# EAGLE design untitled (EAGLE 7.7.0)
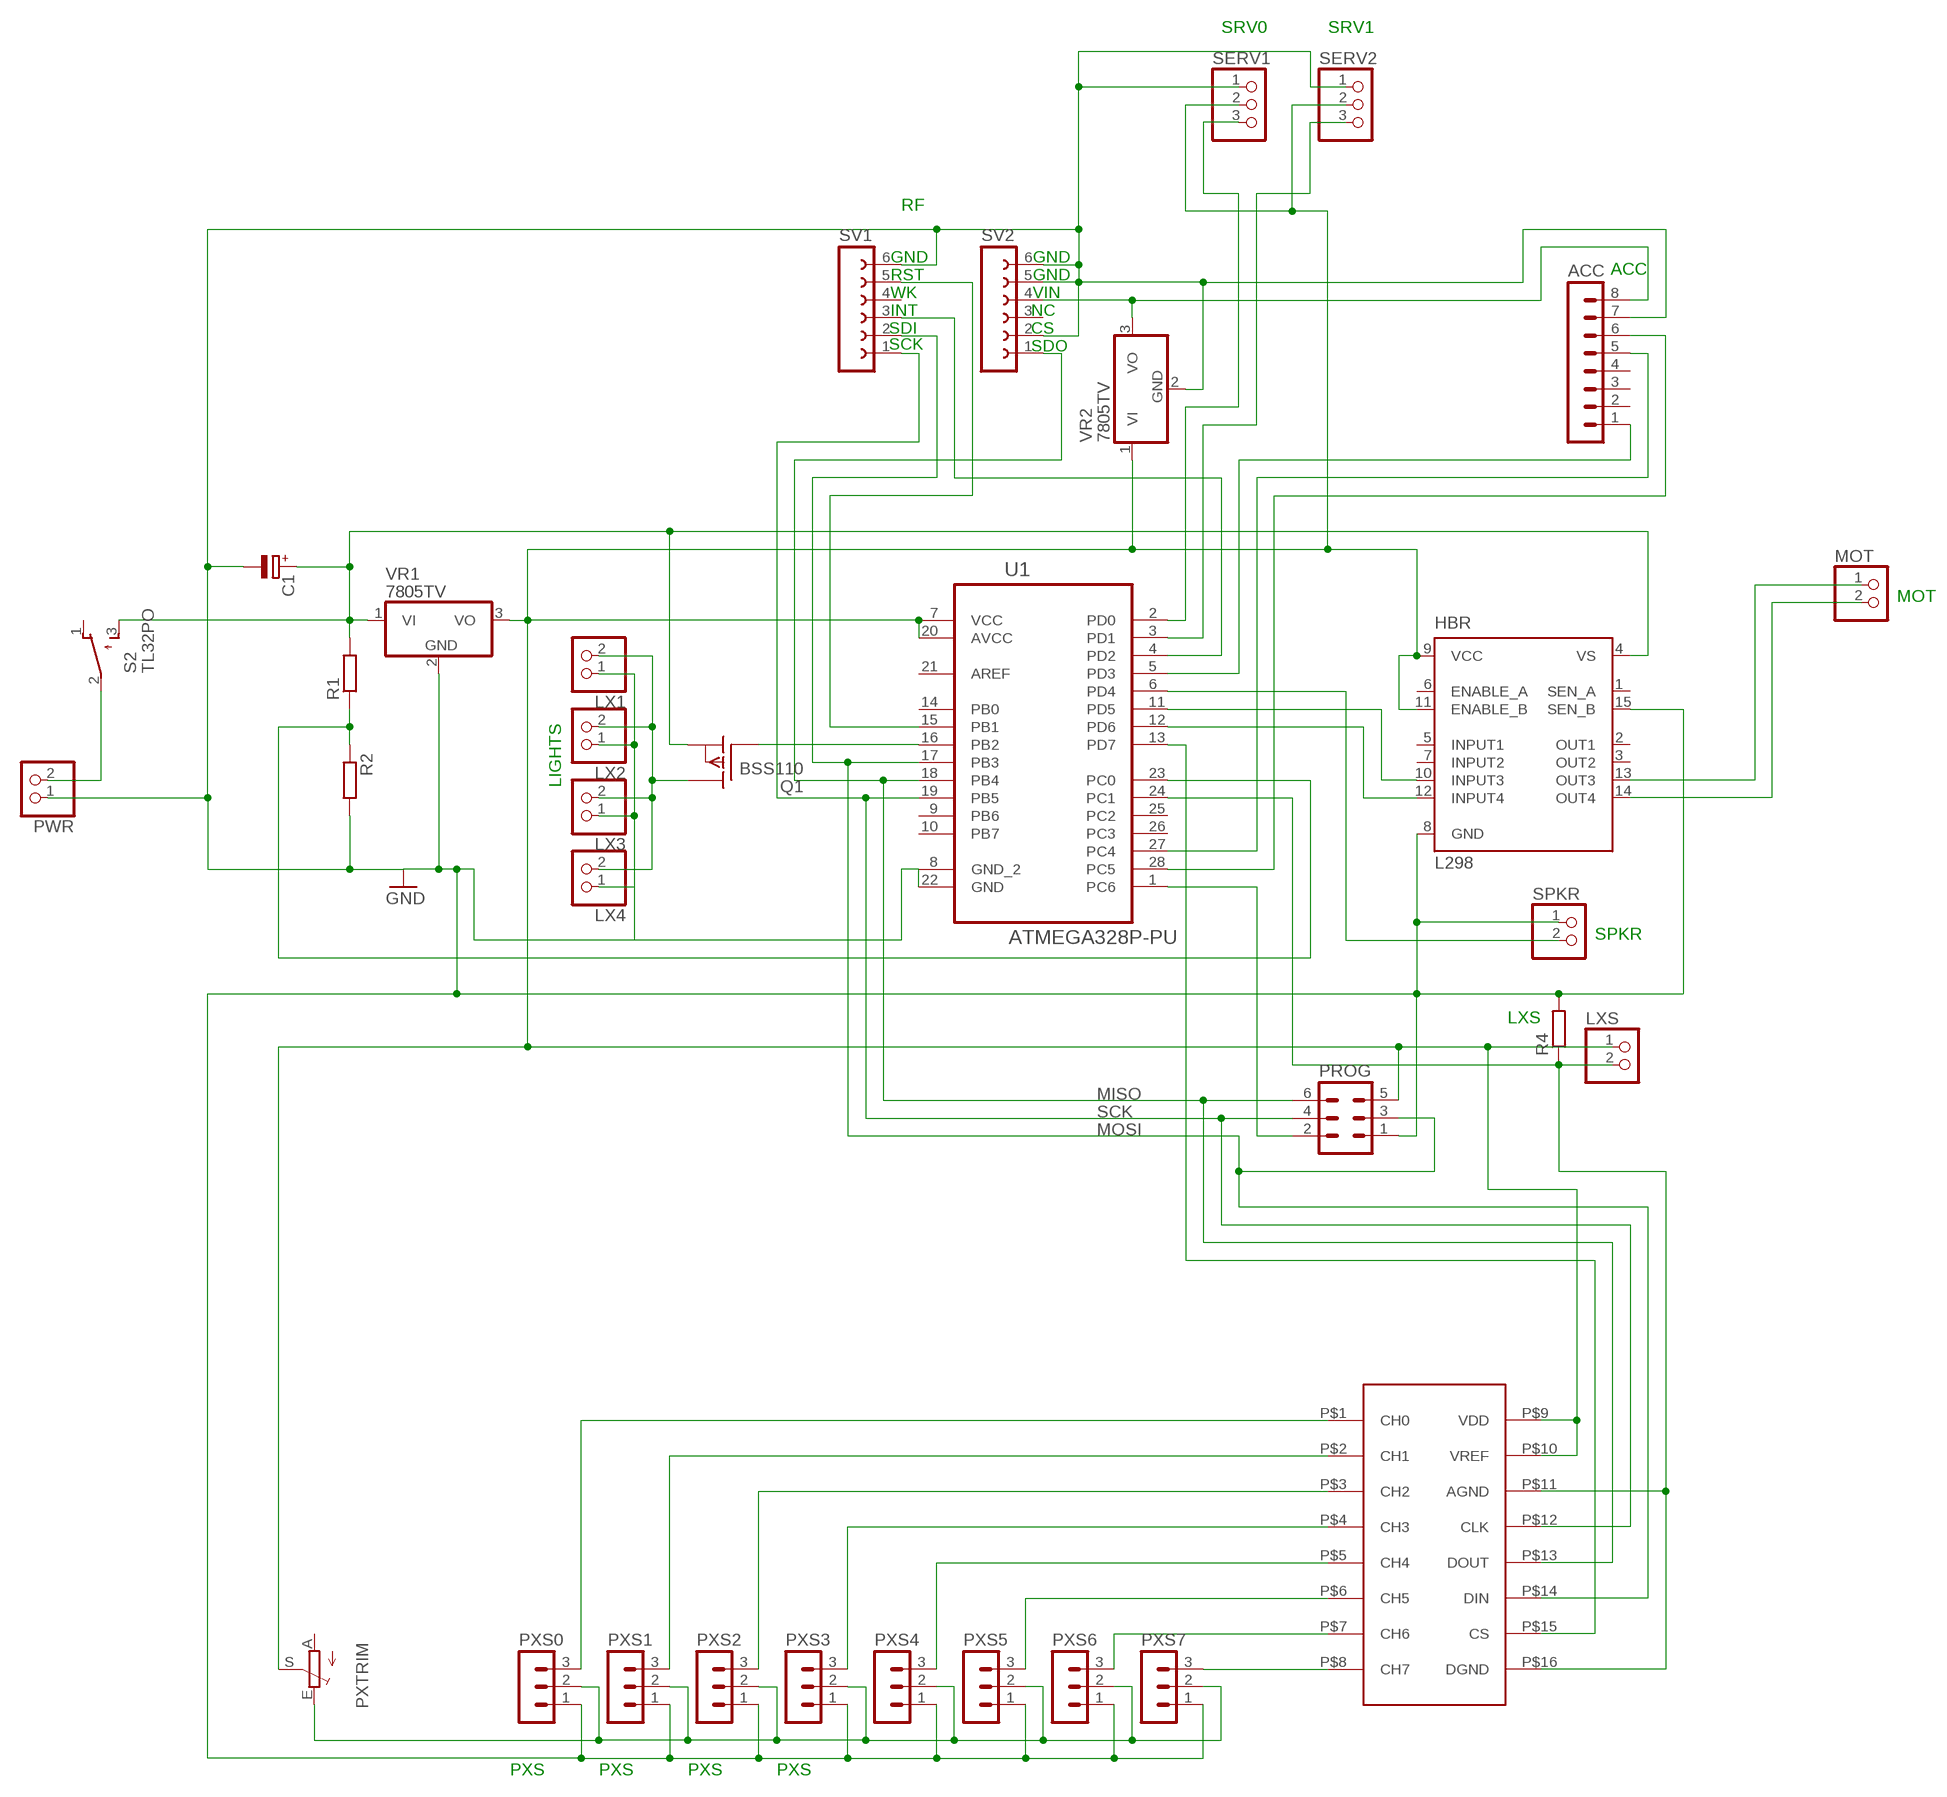
[diagram p0: schematic, sheet 1]

## Parts
ACC  MA08-1  [MA08-1]
C1  CPOL-EUE2.5-7  [E2,5-7]
HBR  L298  [MULTIWATT-15]
LX1  PINHD-1X2  [1X02]
LX2  PINHD-1X2  [1X02]
LX3  PINHD-1X2  [1X02]
LX4  PINHD-1X2  [1X02]
LXS  PINHD-1X2  [1X02]
MOT  PINHD-1X2  [1X02]
PROG  MA03-2  [MA03-2]
PWR  PINHD-1X2  [1X02]
PXS0  MA03-1  [MA03-1]
PXS1  MA03-1  [MA03-1]
PXS2  MA03-1  [MA03-1]
PXS3  MA03-1  [MA03-1]
PXS4  MA03-1  [MA03-1]
PXS5  MA03-1  [MA03-1]
PXS6  MA03-1  [MA03-1]
PXS7  MA03-1  [MA03-1]
PXTRIM  TRIM_EU-CA9V  [CA9V]
Q1  BSS110  [TO92]
R1  R-EU_0309/V  [0309V]
R2  R-EU_0309/V  [0309V]
R4  R-EU_0309/V  [0309V]
S2  TL32PO  [TL3XPO]
SERV1  PINHD-1X3  [1X03]
SERV2  PINHD-1X3  [1X03]
SPKR  PINHD-1X2  [1X02]
SV1  FE06-1  [FE06]
SV2  FE06-1  [FE06]
U1  ATMEGA328P-PU  [DIP254P762X457-28]
U$1  MCP3208  [DIP16]
VR1  7805TV  [TO220V]
VR2  7805TV  [TO220V]

## Nets
GND: ACC.7 C1.- HBR.8(GND) HBR.15(SEN_B) LX1.1 LX2.1 LX3.1 LX4.1 PROG.1 PWR.1 PXS0.1 PXS1.1 PXS2.1 PXS3.1 PXS4.1 PXS5.1 PXS6.1 PXS7.1 R2.2 R4.2 SERV1.1 SERV2.1 SPKR.1 SV1.6 SV2.2 SV2.5 SV2.6 U1.8(GND_2) U1.22(GND) VR1.2(GND) VR2.2(GND)
MISO: PROG.6 SV2.1 U1.18(PB4) U$1.P$13(DOUT)
MOSI: PROG.3 SV1.2 U1.17(PB3) U$1.P$14(DIN)
N$1: R1.1 R2.1 U1.23(PC0)
N$2: U1.13(PD7) U$1.P$15(CS)
N$3: SERV1.3 U1.2(PD0)
N$4: HBR.13(OUT3) MOT.1
N$5: HBR.14(OUT4) MOT.2
N$6: PXS7.3 U$1.P$8(CH7)
N$7: HBR.12(INPUT4) U1.12(PD6)
N$8: PXS6.3 U$1.P$7(CH6)
N$9: PXS5.3 U$1.P$6(CH5)
N$10: ACC.6 U1.28(PC5)
N$11: PXS4.3 U$1.P$5(CH4)
N$12: PXS3.3 U$1.P$4(CH3)
N$13: PXS2.3 U$1.P$3(CH2)
N$14: PXS1.3 U$1.P$2(CH1)
N$15: ACC.5 U1.27(PC4)
N$16: PXS0.3 U$1.P$1(CH0)
N$17: ACC.1 U1.5(PD3)
N$21: HBR.10(INPUT3) U1.11(PD5)
N$24: PXS0.2 PXS1.2 PXS2.2 PXS3.2 PXS4.2 PXS5.2 PXS6.2 PXS7.2 PXTRIM.E
N$25: SERV2.3 U1.3(PD1)
N$26: Q1.2(G) U1.16(PB2)
N$27: SPKR.2 U1.6(PD4)
N$28: LXS.2 R4.1 U1.24(PC1) U$1.P$11(AGND) U$1.P$16(DGND)
N$29: LX1.2 LX2.2 LX3.2 LX4.2 Q1.3(D)
R_INT: SV1.3 U1.4(PD2)
R_RST: SV1.5 U1.15(PB1)
RST: PROG.2 U1.1(PC6)
SCK: PROG.4 SV1.1 U1.19(PB5) U$1.P$12(CLK)
V3V: ACC.8 SV2.4 VR2.3(VO)
VCC: HBR.9(VCC) HBR.11(ENABLE_B) LXS.1 PROG.5 PXTRIM.S SERV1.2 SERV2.2 U1.7(VCC) U1.20(AVCC) U$1.P$9(VDD) U$1.P$10(VREF) VR1.3(VO) VR2.1(VI)
VSS: C1.+ HBR.4(VS) Q1.1(S) R1.2 S2.3(S) VR1.1(VI)
VSS_IN: PWR.2 S2.2(P)
Unconnected: ACC.2 ACC.3 ACC.4 HBR.1(SEN_A) HBR.2(OUT1) HBR.3(OUT2) HBR.5(INPUT1) HBR.6(ENABLE_A) HBR.7(INPUT2) PXTRIM.A S2.1(O) SV1.4 SV2.3 U1.9(PB6) U1.10(PB7) U1.14(PB0) U1.21(AREF) U1.25(PC2) U1.26(PC3)

## Notes on the sheet
- SRV0 | SRV1
- RF
- GND | GND
- ACC
- RST | GND
- WK | VIN
- INT | NC
- SDI | CS
- SCK | SDO
- MOT
- LIGHTS
- SPKR
- LXS
- PXS | PXS | PXS | PXS

## Library data of the parts
ACC = con-lstb:MA08-1: PIN HEADER; OC_FARNELL: unknown; OC_NEWARK: unknown
C1 = rcl:CPOL-EU: POLARIZED CAPACITOR, European symbol
HBR = st-microelectronics:L298: DUAL FULL-BRIDGE DRIVER; MPN: L298N; OC_FARNELL: 1589425; OC_NEWARK: 32M1527
LX1-LX4 LXS MOT PWR SPKR = pinhead:PINHD-1X2: PIN HEADER
PROG = con-lstb:MA03-2: PIN HEADER; OC_FARNELL: unknown; OC_NEWARK: unknown
PXS0 PXS1-PXS7 = con-lstb:MA03-1: PIN HEADER; OC_FARNELL: unknown; OC_NEWARK: unknown
PXTRIM = pot:TRIM_EU-: POTENTIOMETER
Q1 = transistor-fet:BSS110: P-Channel Enhancement MOSFET -50V; -0,17A; 6Ohm
R1 R2 R4 = resistor:R-EU_: RESISTOR, European symbol
S2 = switch:TL32PO: TINY SWITCH ON - MOM Source: http://www2.produktinfo.conrad.com/datenblaetter/700000-724999/705152-da-01-de-Subminiaturschalter_TL_36YO.pdf
SERV1 SERV2 = pinhead:PINHD-1X3: PIN HEADER
SV1 SV2 = con-lsta:FE06-1: FEMALE HEADER; OC_FARNELL: unknown; OC_NEWARK: unknown
U1 = Atmel_By_element14_Batch_1-00:ATMEGA328P-PU: 8-bit Microcontroller with In-System Programmable Flash; MPN: ATMEGA328P-PU; OC_FARNELL: 1715487; OC_NEWARK: 15R0268; PACKAGE: PDIP-28; SUPPLIER: Atmel
U$1 = MCP_ADC:MCP3208
VR1 VR2 = linear:78*: Positive VOLTAGE REGULATOR Source: http://cache.national.com/ds/LM/LM78L05.pdf http://www.fairchildsemi.com/ds/LM/LM7805.pdf

## Board
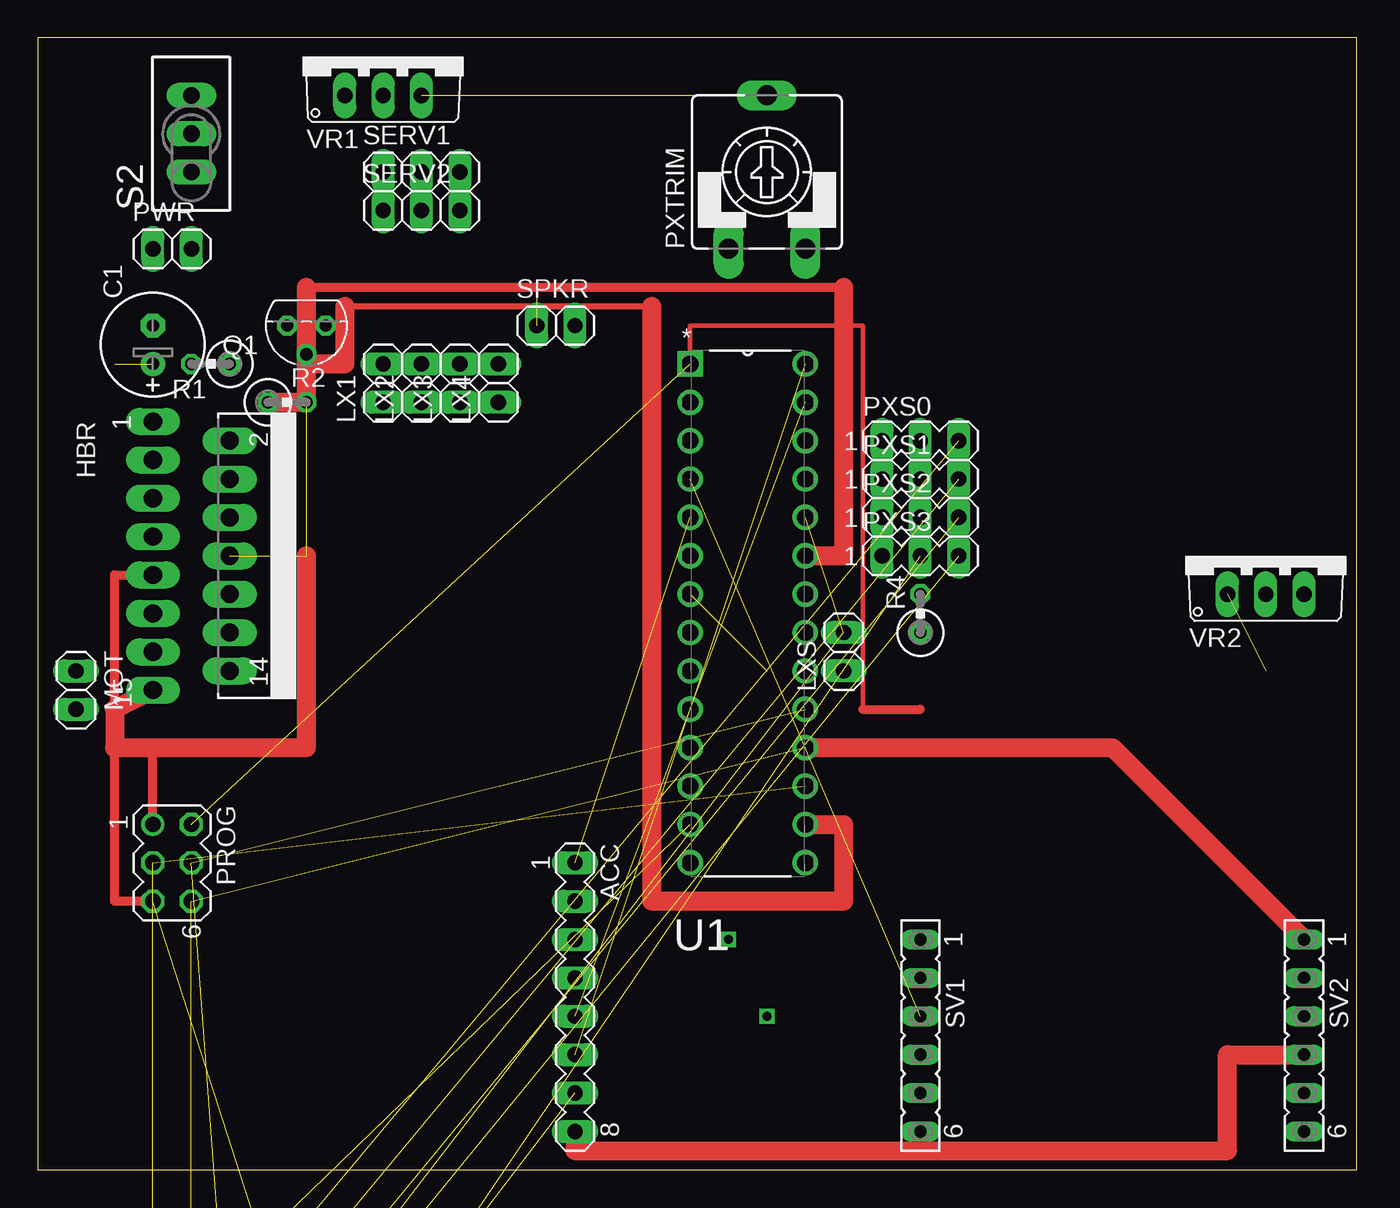
[diagram p1: board, top side]
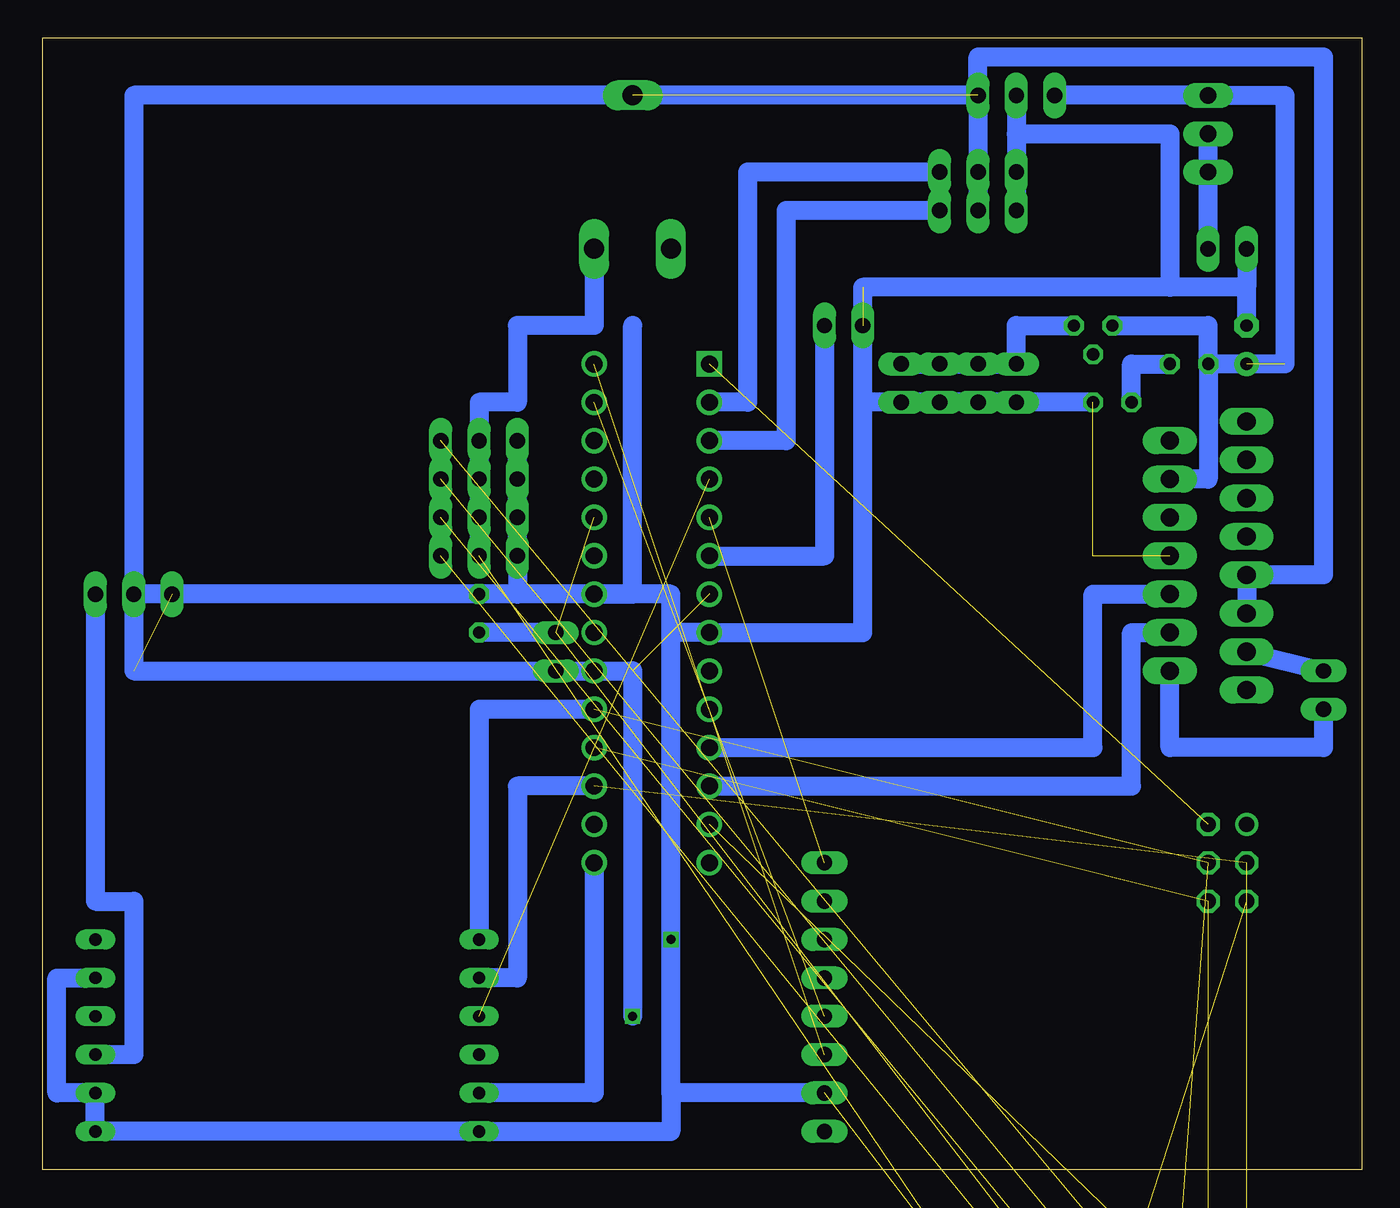
[diagram p2: board, bottom side, seen from below]

Size 87.3 x 74.92 mm. Coordinates in mm from the lower left corner, seen from the top.
Outline: 0,0 87.3,0 87.3,74.92 0,74.92 0,0
Copper layers (1*16): Top 0.035mm / dielectric 1.5mm / Bottom 0.035mm
Design rules "default": minimum track width 10mil, minimum drill 24mil, track to track 8mil, track to pad 8mil, pad to pad 8mil, via to via 8mil, smd to smd 8mil, copper to edge 40mil, drill to drill 8mil, minimum pad ring 10mil, minimum via ring 8mil, stop-mask expansion 4mil, vias tented up to drill 0mil, thermal gap 10mil

### Footprints (pad centres in the part's own frame; a part is rotated, then mirrored left to right if it is on the bottom)
MA08-1 = drill 1.016 long: 1 -8.89,0; 2 -6.35,0; 3 -3.81,0; 4 -1.27,0; 5 1.27,0; 6 3.81,0; 7 6.35,0; 8 8.89,0
E2,5-7 = drill 0.813 pad 1.6: + -1.27,0 | drill 0.813 pad 1.6 octagon: - 1.27,0
MULTIWATT-15 = drill 1.2 long: 1 -8.89,-7.62; 2 -7.62,-2.54; 3 -6.35,-7.62; 4 -5.08,-2.54; 5 -3.81,-7.62; 6 -2.54,-2.54; 7 -1.27,-7.62; 8 0,-2.54; 9 1.27,-7.62; 10 2.54,-2.54; 11 3.81,-7.62; 12 5.08,-2.54; 13 6.35,-7.62; 14 7.62,-2.54; 15 8.89,-7.62
1X02 = drill 1.016 long: 1 -1.27,0; 2 1.27,0
MA03-2 = drill 1.016: 1 -2.54,-1.27 | drill 1.016 octagon: 2 -2.54,1.27; 3 0,-1.27; 4 0,1.27; 5 2.54,-1.27; 6 2.54,1.27
MA03-1 = drill 1.016 long: 1 -2.54,0; 2 0,0; 3 2.54,0
CA9V = drill 1.321 long: A -2.54,-5.08; E 2.54,-5.08; S 0,5.08
TO92 = drill 0.813 octagon: 1 1.27,0; 2 0,1.905; 3 -1.27,0
0309V = drill 0.813 octagon: 1 -1.27,0; 2 1.27,0
TL3XPO = drill 1.1 pad 1.422 long: 1 -2.54,0; 2 0,0; 3 2.54,0
1X03 = drill 1.016 long: 1 -2.54,0; 2 0,0; 3 2.54,0
FE06 = drill 0.813 long: 1 -6.35,0; 2 -3.81,0; 3 -1.27,0; 4 1.27,0; 5 3.81,0; 6 6.35,0
DIP254P762X457-28 = drill 1.118 square: 1 -7.62,33.02 | drill 1.118: 2 -7.62,30.48; 3 -7.62,27.94; 4 -7.62,25.4; 5 -7.62,22.86; 6 -7.62,20.32; 7 -7.62,17.78; 8 -7.62,15.24; 9 -7.62,12.7; 10 -7.62,10.16; 11 -7.62,7.62; 12 -7.62,5.08; 13 -7.62,2.54; 14 -7.62,0; 15 0,0; 16 0,2.54; 17 0,5.08; 18 0,7.62; 19 0,10.16; 20 0,12.7; 21 0,15.24; 22 0,17.78; 23 0,20.32; 24 0,22.86; 25 0,25.4; 26 0,27.94; 27 0,30.48; 28 0,33.02
DIP16 = drill 0.8 long: P$1 -10.16,-3.81; P$2 -7.62,-3.81; P$3 -5.08,-3.81; P$4 -2.54,-3.81; P$5 0,-3.81; P$6 2.54,-3.81; P$7 5.08,-3.81; P$8 7.62,-3.81; P$9 7.62,3.81; P$10 5.08,3.81; P$11 2.54,3.81; P$12 0,3.81; P$13 -2.54,3.81; P$14 -5.08,3.81; P$15 -7.62,3.81; P$16 -10.16,3.81
TO220V = drill 1.016 long: 1 -2.54,-2.54; 2 0,-2.54; 3 2.54,-2.54

### Placement (x,y rotation side)
ACC  35.56,11.43 270 top
C1  7.62,54.61 90 top
HBR  15.24,40.64 270 top
LX1  22.86,52.07 90 top
LX2  25.4,52.07 90 top
LX3  27.94,52.07 90 top
LX4  30.48,52.07 90 top
LXS  53.34,34.29 90 top
MOT  2.54,31.75 270 top
PROG  8.89,20.32 270 top
PWR  8.89,60.96 0 top
PXS0  58.42,48.26 0 top
PXS1  58.42,45.72 0 top
PXS2  58.42,43.18 0 top
PXS3  58.42,40.64 0 top
PXS4  5.08,-38.1 0 top  (outside the outline)
PXS5  5.08,-53.34 0 top  (outside the outline)
PXS6  5.08,-68.58 0 top  (outside the outline)
PXS7  5.08,-83.82 0 top  (outside the outline)
PXTRIM  48.26,66.04 0 top
Q1  17.78,55.88 180 top
R1  11.43,53.34 180 top
R2  16.51,50.8 0 top
R4  58.42,36.83 90 top
S2  10.16,68.58 90 top
SERV1  25.4,66.04 0 top
SERV2  25.4,63.5 0 top
SPKR  34.29,55.88 0 top
SV1  58.42,8.89 270 top
SV2  83.82,8.89 270 top
U1  50.8,20.32 0 top
U$1  12.7,-17.78 0 top  (outside the outline)
VR1  22.86,73.66 0 top
VR2  81.28,40.64 0 top

### Tracks (layer width: path | path; a pad name or v marks a point on that pad's centre or on a via)
GND  (via drill 0.6)  (7 unrouted)
  Top 0.61: PROG.1 7.62,27.94
  Top 1.27: HBR.15 5.08,30.48 5.08,27.94 7.62,27.94 17.78,27.94 17.78,40.64
  Bottom 1.27: PWR.1 7.62,58.42 | VR1.2 22.86,68.58 | 22.86,68.58 12.7,68.58 12.7,58.42 | 45.72,35.56 U1.8 33.02,35.56 33.02,40.64 33.02,50.8 | 45.72,35.56 45.72,38.1 U1.22 | U1.22 48.26,38.1 48.26,55.88 | 22.86,68.58 SERV1.1 SERV2.1 | 33.02,50.8 33.02,58.42 12.7,58.42 | 45.72,5.08 v45.72,15.24 45.72,35.56 | SV2.2 86.36,12.7 86.36,5.08 SV2.5 SV2.6 SV1.6 45.72,2.54 45.72,5.08 | U1.22 R4.2 | R4.2 VR2.2 | 33.02,50.8 LX4.1 LX3.1 LX2.1 LX1.1 R2.2 | ACC.7 45.72,5.08 | R4.2 55.88,38.1 PXS3.1 PXS2.1 PXS1.1 PXS0.1 | C1.- 7.62,58.42 | 7.62,58.42 12.7,58.42
MISO  (2 unrouted)
  Top 1.27: U1.18 71.12,27.94 SV2.1
MOSI  (2 unrouted)
  Bottom 1.27: U1.17 55.88,25.4 55.88,12.7 SV1.2
N$1
  Top 0.61: 17.78,58.42 53.34,58.42
  Top 1.27: R2.1 17.78,50.8 17.78,58.42 | 53.34,58.42 53.34,40.64 U1.23
  Bottom 1.27: R2.1 15.24,53.34 R1.1
N$2  (1 unrouted)
N$3
  Bottom 1.27: SERV1.3 40.64,66.04 40.64,50.8 U1.2
N$4
  Bottom 1.27: HBR.13 MOT.1
N$5
  Bottom 1.27: MOT.2 2.54,27.94 12.7,27.94 HBR.14
N$6  (1 unrouted)
N$7
  Bottom 1.27: U1.12 15.24,25.4 15.24,35.56 HBR.12
N$8  (1 unrouted)
N$9  (1 unrouted)
N$10  (1 unrouted)
N$11  (1 unrouted)
N$12  (1 unrouted)
N$13  (1 unrouted)
N$14  (1 unrouted)
N$15  (1 unrouted)
N$16  (1 unrouted)
N$17  (1 unrouted)
N$21
  Bottom 1.27: U1.11 17.78,27.94 17.78,38.1 HBR.10
N$24  (4 unrouted)
  Bottom 1.27: PXTRIM.E 50.8,55.88 55.88,55.88 55.88,50.8 58.42,50.8 PXS0.2 PXS1.2 PXS2.2 PXS3.2
N$25
  Bottom 1.27: SERV2.3 38.1,63.5 38.1,48.26 U1.3
N$26
  Top 0.406: 40.64,57.15 20.32,57.15
  Top 1.27: U1.16 53.34,22.86 53.34,17.78 40.64,17.78 40.64,57.15 | 20.32,57.15 20.32,53.34 17.78,53.34 Q1.2
N$27
  Bottom 1.27: U1.6 35.56,40.64 SPKR.2
N$28  (3 unrouted)
  Bottom 1.27: LXS.2 R4.1
N$29
  Bottom 1.27: Q1.3 22.86,55.88 LX1.2 LX2.2 LX3.2 LX4.2
R_INT  (1 unrouted)
R_RST
  Bottom 1.27: U1.15 50.8,5.08 SV1.5
RST  (1 unrouted)
  Top 0.305: U1.1 43.18,55.88 54.61,55.88 54.61,30.48
  Top 0.61: 54.61,30.48 58.42,30.48
SCK  (2 unrouted)
  Bottom 1.27: U1.19 58.42,30.48 SV1.1
V3V
  Top 1.27: SV2.4 78.74,7.62 78.74,1.27 35.56,1.27 ACC.8
  Bottom 1.27: VR2.3 83.82,17.78 81.28,17.78 81.28,7.62 SV2.4
VCC  (via drill 0.6)  (5 unrouted)
  Top 0.61: PROG.5 5.08,17.78 5.08,39.37 HBR.9
  Bottom 1.27: VR1.3 81.28,71.12 81.28,33.02 LXS.1 U1.20 48.26,33.02 v48.26,10.16 | VR1.3 SERV1.2 SERV2.2 | HBR.11 HBR.9 2.54,39.37 2.54,73.66 25.4,73.66 VR1.3
VSS  (1 unrouted)
  Bottom 1.27: VR1.1 S2.3 5.08,71.12 5.08,53.34 R1.2 | Q1.1 10.16,55.88 R1.2 | R1.2 10.16,45.72 HBR.4
VSS_IN
  Bottom 1.27: PWR.2 S2.2